# EAGLE design interstage_mini (EAGLE 9.2.2)
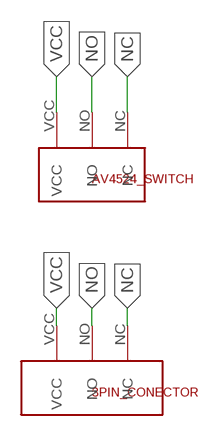
[diagram p0: schematic, sheet 1]

## Parts
U$1  CONECTOR  [CONECTOR]
U$2  SWITCH  [SWITCH]

## Nets
NC: U$1.NC U$2.NC
NO: U$1.NO U$2.NO
VCC: U$1.VCC U$2.VCC

## Library data of the parts
U$1 = conector:CONECTOR
U$2 = SWITCH:SWITCH

## Board
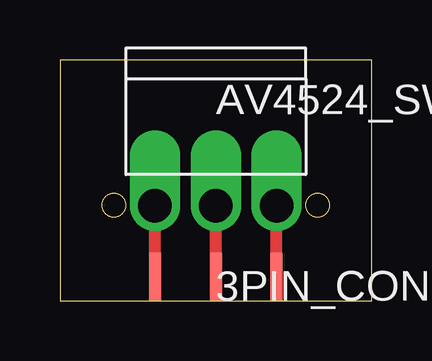
[diagram p1: board, top side]

Size 13 x 10.06 mm. Coordinates in mm from the lower left corner, seen from the top.
Outline: 0,0 13,0 13,10.06 0,10.06 0,0
Outline: circle at 2.25,4 radius 0.5
Outline: circle at 10.75,4 radius 0.5
Copper layers (1*16): Top 0.035mm / dielectric 1.5mm / Bottom 0.035mm
Design rules "default *": minimum track width 6mil, minimum drill 0.35mm, track to track 6mil, track to pad 6mil, pad to pad 6mil, via to via 6mil, smd to smd 6mil, copper to edge 0mil, drill to drill 6mil, minimum pad ring 10mil, minimum via ring 8mil, stop-mask expansion 4mil, vias tented up to drill 0mil, thermal gap 10mil

### Footprints (pad centres in the part's own frame; a part is rotated, then mirrored left to right if it is on the bottom)
CONECTOR = smd 0.5 x 2: NC 2.54,1; NO 0,1; VCC -2.54,1
SWITCH = drill 1.4 pad 2 offset: NC 2.54,0; NO 0,0; VCC -2.54,0

### Placement (x,y rotation side)
U$1  6.5,0 0 top
U$2  6.5,3.97 0 top

### Tracks (layer width: path | path; a pad name or v marks a point on that pad's centre or on a via)
NC
  Top 0.5: U$1.NC U$2.NC
NO
  Top 0.5: U$1.NO U$2.NO
VCC
  Top 0.5: U$1.VCC U$2.VCC